# EAGLE schematic wifi Shield V1.1 (EAGLE 6.1)
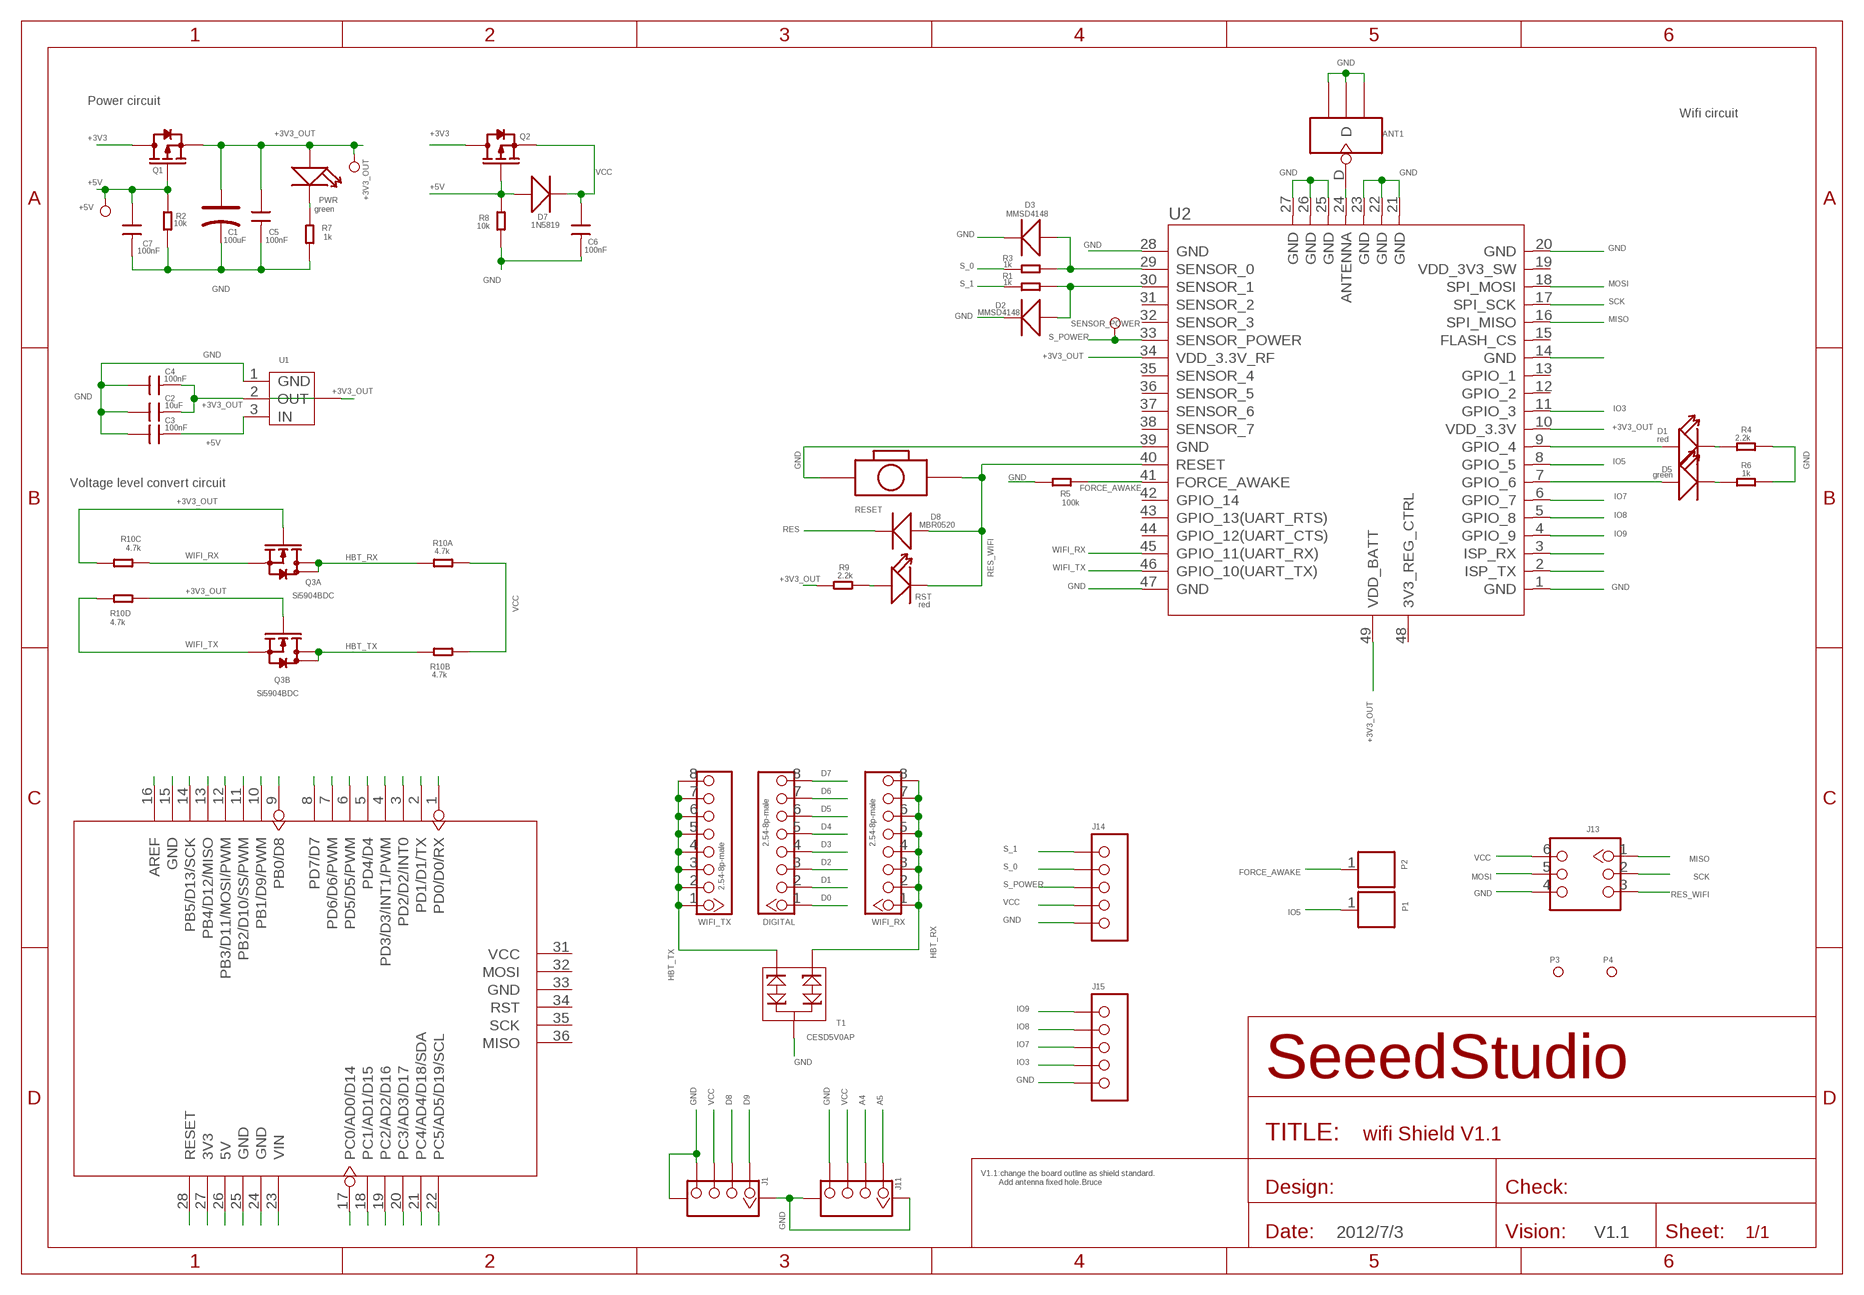
[diagram p0: schematic, sheet 1]

## Parts
+3V3_OUT  PAD-TEST-POINT-CIRCLE_SIZE_3030  [TP_3535]
+5V  PAD-TEST-POINT-CIRCLE_SIZE_3030  [TP_3535]
ANT1  ANTENNA-U-FL  [4P-U-FL]
C1  100uF  CAP-AVX-B  [AVX-B]
C2  10uF  C-0603  [0603]
C3  100nF  C-0603  [0603]
C4  100nF  C-0603  [0603]
C5  100nF  C-0603  [0603]
C6  100nF  C-0603  [0603]
C7  100nF  C-0603  [0603]
D1  red  LED'0603'  [LED-0603]
D2  MMSD4148  D-MBR0520LT1  [SOD123-2.7X1.6]
D3  MMSD4148  D-MBR0520LT1  [SOD123-2.7X1.6]
D5  green  LED'0603'  [LED-0603]
D7  1N5819  D-SMA  [D2010]
D8  MBR0520  D-MBR0520LT1  [SOD123-2.7X1.6]
DIGITAL  2.54-8p-male  HEADER-8P-2.54  [8P-2.54]
J1  TWIG-4P-2.0-SMD-FEMALE-REINFORCE'90D'  [4P-SMD-2.0-90D]
J11  TWIG-4P-2.0-SMD-FEMALE-REINFORCE'90D'  [4P-SMD-2.0-90D]
J13  HEADER-2X3P-2.54  [2X3P-2.54]
J14  HEADER-5P-2.54  [5P-2.54]
J15  HEADER-5P-2.54  [5P-2.54]
P1  PAD'60/30'  [1P-65/35MIL]
P2  PAD'60/30'  [1P-65/35MIL]
P3  PAD-MARK  [ROUND-MARK-1.0]
P4  PAD-MARK  [ROUND-MARK-1.0]
PWR  green  LED'0603'  [LED-0603]
Q1  MOSFET-P'SI2323CDS/SI2305DS<BR>'  [SOT23]
Q2  MOSFET-P'SI2323CDS/SI2305DS<BR>'  [SOT23]
Q3  Si5904BDC  010-DUAL-N-MOSFET_1206-8  [1206-8]
R1  1k  R-0603  [0603]
R2  10k  R-0603  [0603]
R3  1k  R-0603  [0603]
R4  2.2k  R-0603  [0603]
R5  100k  R-0603  [0603]
R6  1k  R-0603  [0603]
R7  1k  R-0603  [0603]
R8  10k  R-0603  [0603]
R9  2.2k  R-0603  [0603]
R10  4.7k  005-4R_1206  [R1206-8]
RESET  BOTTON-2P-90  [2P-7.62X3.56-90D]
RST  red  LED'0603'  [LED-0603]
SENSOR_POWER  PAD-TEST-POINT-CIRCLE_SIZE_3030  [TP_3535]
T1  CESD5V0AP  D-ESD-PESDXL2BT  [SOT23]
U1  LD1117SOT89  [SOT89]
U2  WIFI-RN-171  [49P-1.27-26.67X17.78]
U4  ARDUINO  [ARDUINO]
WIFI_RX  2.54-8p-male  HEADER-8P-2.54  [8P-2.54]
WIFI_TX  2.54-8p-male  HEADER-8P-2.54  [8P-2.54]

## Nets
+3V3: Q1.3(D) Q2.3(D) U4.27(3V3)
+3V3_OUT: +3V3_OUT.T C1.+ C2.2 C4.2 C5.1 PWR.+ Q1.2(S) Q3.2(A:G) Q3.4(B:G) R9.2 R10.5 R10.6 U1.2(OUT) U1.4(TAB) U2.10(VDD_3.3V) U2.34(VDD_3.3V_RF) U2.49(VDD_BATT)
+5V: +5V.T C3.2 C7.1 D7.+ Q1.1(G) Q2.1(G) R2.1 R8.1 U1.3(IN) U4.26(5V)
A0: U4.17(PC0/AD0/D14)
A1: U4.18(PC1/AD1/D15)
A2: U4.19(PC2/AD2/D16)
A3: U4.20(PC3/AD3/D17)
A4: J11.2 U4.21(PC4/AD4/D18/SDA)
A5: J11.1 U4.22(PC5/AD5/D19/SCL)
AREF: U4.16(AREF)
D0: DIGITAL.1 U4.1(PD0/D0/RX)
D1: DIGITAL.2 U4.2(PD1/D1/TX)
D2: DIGITAL.3 U4.3(PD2/D2/INT0)
D3: DIGITAL.4 U4.4(PD3/D3/INT1/PWM)
D4: DIGITAL.5 U4.5(PD4/D4)
D5: DIGITAL.6 U4.6(PD5/D5/PWM)
D6: DIGITAL.7 U4.7(PD6/D6/PWM)
D7: DIGITAL.8 U4.8(PD7/D7)
D8: J1.2 U4.9(PB0/D8)
D9: J1.1 U4.10(PB1/D9/PWM)
D10: U4.11(PB2/D10/SS/PWM)
D11: U4.12(PB3/D11/MOSI/PWM)
D12: U4.13(PB4/D12/MISO)
D13: U4.14(PB5/D13/SCK)
FORCE_AWAKE: P2.1 R5.1 U2.41(FORCE_AWAKE)
GND: ANT1.GND1 ANT1.GND2 ANT1.GND3 C1.- C2.1 C3.1 C4.1 C5.2 C6.2 C7.2 D2.1(-) D3.1(-) J1.4 J1.SS1 J1.SS2 J11.4 J11.SS1 J11.SS2 J13.4 J14.5 J15.5 R2.2 R4.1 R5.2 R6.1 R7.1 R8.2 RESET.P$2 T1.3 U1.1(GND) U2.1(GND) U2.14(GND) U2.20(GND) U2.21(GND) U2.22(GND) U2.23(GND) U2.25(GND) U2.26(GND) U2.27(GND) U2.28(GND) U2.39(GND) U2.47(GND) U4.15(GND) U4.24(GND) U4.25(GND)
HBT_RX: Q3.7(A:D) Q3.8(A:D) R10.1 T1.1 WIFI_RX.1 WIFI_RX.2 WIFI_RX.3 WIFI_RX.4 WIFI_RX.5 WIFI_RX.6 WIFI_RX.7 WIFI_RX.8
HBT_TX: Q3.5(B:D) Q3.6(B:D) R10.2 T1.2 WIFI_TX.1 WIFI_TX.2 WIFI_TX.3 WIFI_TX.4 WIFI_TX.5 WIFI_TX.6 WIFI_TX.7 WIFI_TX.8
IO3: J15.4 U2.11(GPIO_3)
IO5: P1.1 U2.8(GPIO_5)
IO7: J15.3 U2.6(GPIO_7)
IO8: J15.2 U2.5(GPIO_8)
IO9: J15.1 U2.4(GPIO_9)
MISO: J13.1 U2.16(SPI_MISO)
MOSI: J13.5 U2.18(SPI_MOSI)
N$1: R9.1 RST.+
N$2: D3.2(+) R3.1 U2.29(SENSOR_0)
N$3: D2.2(+) R1.1 U2.30(SENSOR_1)
N$10: U2.2(ISP_TX)
N$11: U2.3(ISP_RX)
N$15: D5.+ U2.7(GPIO_6)
N$20: ANT1.D U2.24(ANTENNA)
N$22: D1.+ U2.9(GPIO_4)
N$23: D5.- R6.2
N$25: D1.- R4.2
N$26: PWR.- R7.2
RES: D8.1(-) U4.28(RESET)
RES_WIFI: D8.2(+) J13.3 RESET.P$1 RST.- U2.40(RESET)
S_0: J14.2 R3.2
S_1: J14.1 R1.2
S_POWER: J14.3 SENSOR_POWER.T U2.33(SENSOR_POWER)
SCK: J13.2 U2.17(SPI_SCK)
VCC: C6.1 D7.- J1.3 J11.3 J13.6 J14.4 Q2.2(S) R10.7 R10.8
VIN: U4.23(VIN)
WIFI_RX: Q3.1(A:S) R10.3 U2.45(GPIO_11(UART_RX))
WIFI_TX: Q3.3(B:S) R10.4 U2.46(GPIO_10(UART_TX))
Unconnected: U2.12(GPIO_2) U2.13(GPIO_1) U2.15(FLASH_CS) U2.19(VDD_3V3_SW) U2.31(SENSOR_2) U2.32(SENSOR_3) U2.35(SENSOR_4) U2.36(SENSOR_5) U2.37(SENSOR_6) U2.38(SENSOR_7) U2.42(GPIO_14) U2.43(GPIO_13(UART_RTS)) U2.44(GPIO_12(UART_CTS)) U2.48(3V3_REG_CTRL) U4.31(VCC) U4.32(MOSI) U4.33(GND) U4.34(RST) U4.35(SCK) U4.36(MISO)

## Notes on the sheet
- Power circuit
- Wifi circuit
- Voltage level convert circuit
- V1.1:change the board outline as shield standard.
- Add antenna fixed hole.Bruce
- 2012/7/3 | V1.1

## Library data of the parts
+3V3_OUT +5V SENSOR_POWER = Discrete:PAD-TEST-POINT-CIRCLE
ANT1 = Connector:ANTENNA-U-FL
C1 = Discrete:CAP*: Electrolytic Capacitors,Tantalum Capacitors and Super Capacitors
C2-C7 = Discrete:C*: Ceramic Capacitors
D1 D5 PWR RST = Discrete:LED*
D2 D3 D7 D8 = Discrete:D*
DIGITAL WIFI_RX WIFI_TX = Connector:HEADER-8P
J1 J11 = Connector:TWIG-4P-2.0-SMD-FEMALE-REINFORCE
J13 = Connector:HEADER-2X3P
J14 J15 = Connector:HEADER-5P
P1 P2 = Discrete:PAD
P3 P4 = Discrete:PAD-MARK; PARTNO: DNP
Q1 Q2 = Discrete:MOSFET-P
Q3 = Discrete:010-DUAL-N-MOSFET*: Si5902BDC Si5904DC Si5908DC Si5920DC
R1-R9 = Discrete:R*
R10 = Discrete:005-4R*: Resistor Array
RESET = Discrete:BOTTON-2P
T1 = Discrete:D-ESD-PESDXL2BT
U1 = IC:LD1117: Low Drop Fixed And Adjustable Positive Voltage Regulators http://www.datasheetcatalog.org/datasheet/SGSThomsonMicroelectronics/mXuqtqv.pdf
U2 = Module:WIFI-RN-171: WIFLY GSX 802.11 b/g wireless LAN Module
U4 = moudle:ARDUINO

## Net classes
0 default: width 0.003 mm, drill 0.254 mm, clearance 0.152 mm